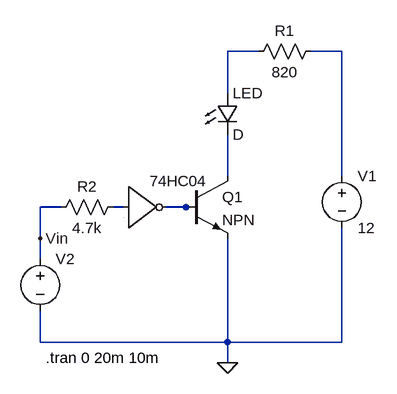
[diagram p0: schematic lab4_3.asc]
lab4_3.asc, the LTspice schematic file:
Version 4
SHEET 1 880 680
WIRE 416 -160 368 -160
WIRE 544 -160 496 -160
WIRE 368 -96 368 -160
WIRE 368 32 368 -32
WIRE 544 32 544 -160
WIRE 112 80 80 80
WIRE 208 80 192 80
WIRE 304 80 272 80
WIRE 320 80 304 80
WIRE 80 128 80 80
WIRE 80 160 80 128
WIRE 80 288 80 240
WIRE 368 288 368 128
WIRE 368 288 80 288
WIRE 544 288 544 112
WIRE 544 288 368 288
WIRE 368 320 368 288
FLAG 368 320 0
FLAG 80 128 Vin
SYMBOL voltage 80 144 R0
WINDOW 3 24 96 Invisible 2
WINDOW 123 0 0 Left 0
WINDOW 39 0 0 Left 0
SYMATTR Value PULSE(0 5 0 0 0 1e-3 2e-3)
SYMATTR InstName V2
SYMBOL res 96 96 R270
WINDOW 0 32 56 VTop 2
WINDOW 3 0 56 VBottom 2
SYMATTR InstName R2
SYMATTR Value 4.7k
SYMBOL res 400 -144 R270
WINDOW 0 32 56 VTop 2
WINDOW 3 0 56 VBottom 2
SYMATTR InstName R1
SYMATTR Value 820
SYMBOL voltage 544 16 R0
WINDOW 123 0 0 Left 0
WINDOW 39 0 0 Left 0
SYMATTR InstName V1
SYMATTR Value 12
SYMBOL LED 352 -96 R0
SYMATTR InstName LED
SYMBOL npn 304 32 R0
SYMATTR InstName Q1
SYMBOL Digital\\inv 208 16 R0
SYMATTR InstName 74HC04
TEXT 88 312 Left 2 !.tran 0 20m 10m

The netlist it stands for:
* lab4_3.asc
V2 Vin 0 PULSE(0 5 0 0 0 1e-3 2e-3)
R2 Vin N004 4.7k
R1 N001 N002 820
V1 N002 0 12
D§LED N001 N003 D
Q1 N003 N005 0 0 NPN
A§74HC04 N004 0 0 0 0 N005 0 0 BUF
.model D D
.lib standard.dio
.model NPN NPN
.model PNP PNP
.lib standard.bjt
.tran 0 20m 10m
.backanno
.end